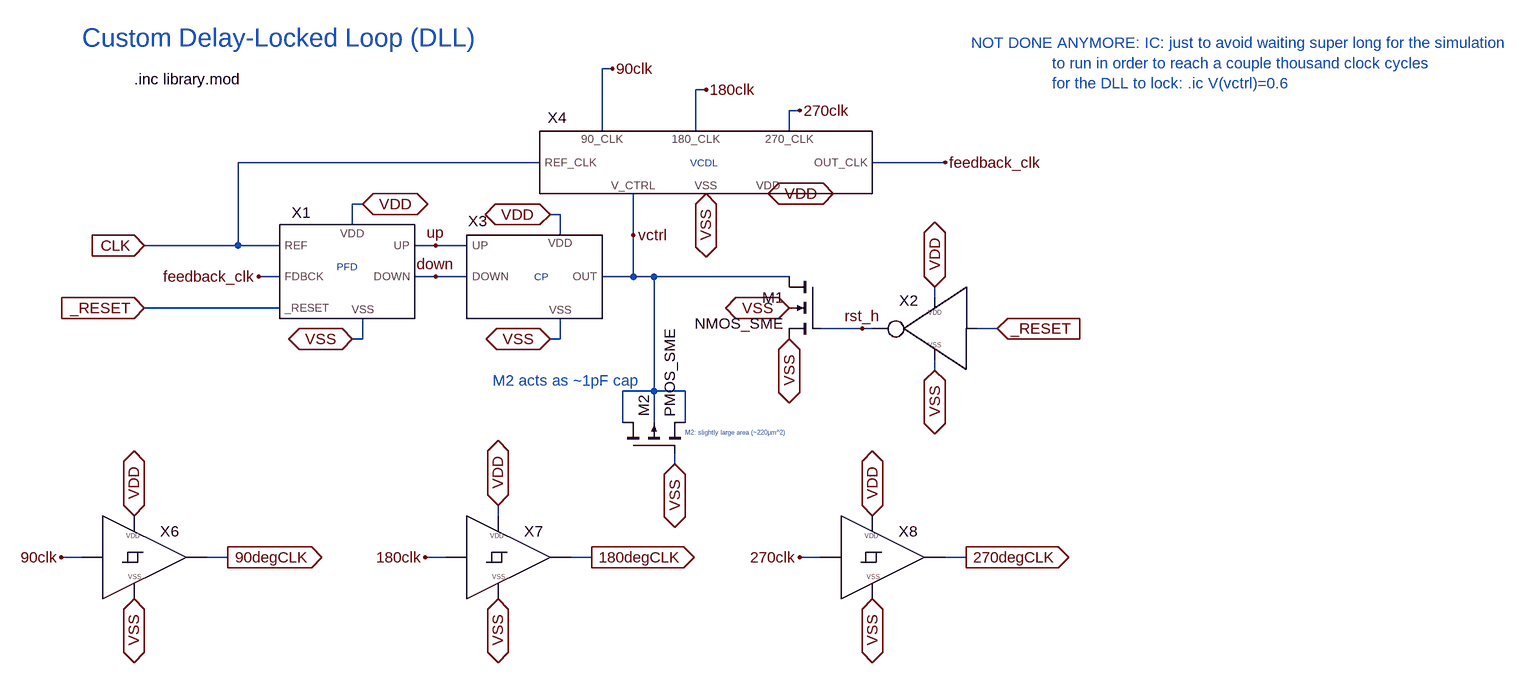
[diagram p0: schematic my_dll.asc]
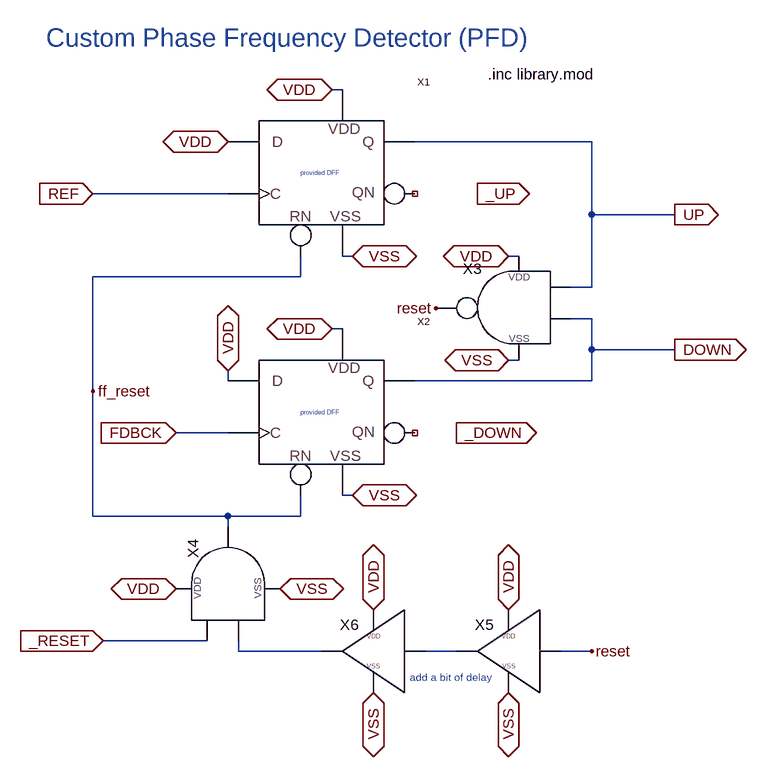
[diagram p1: sub-circuit my_pfd.asc]
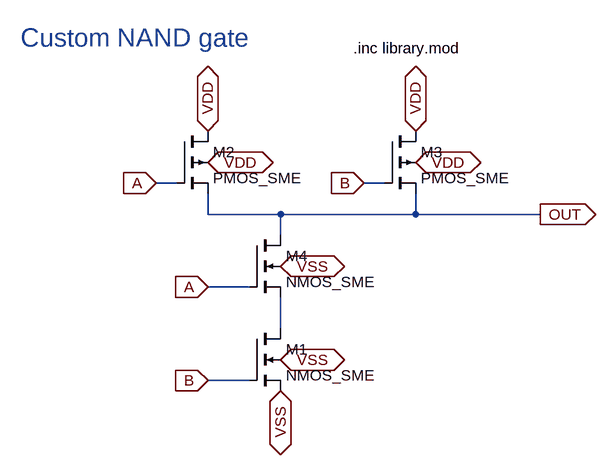
[diagram p2: sub-circuit my_nand.asc]
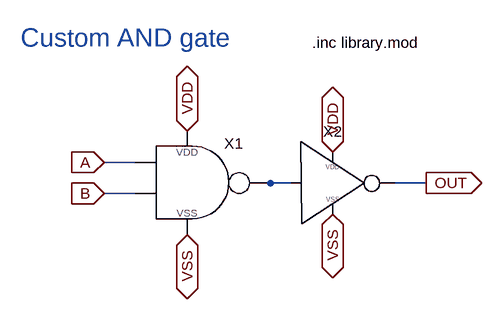
[diagram p3: sub-circuit my_and.asc]
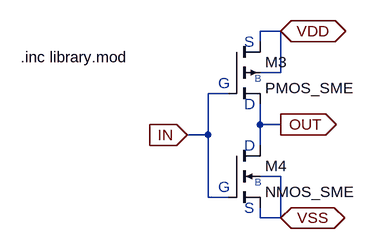
[diagram p4: sub-circuit my_inverter.asc]
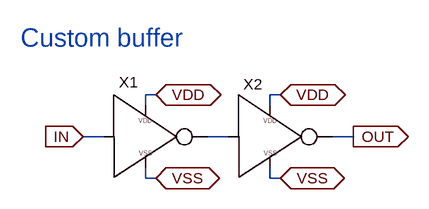
[diagram p5: sub-circuit my_buffer.asc]
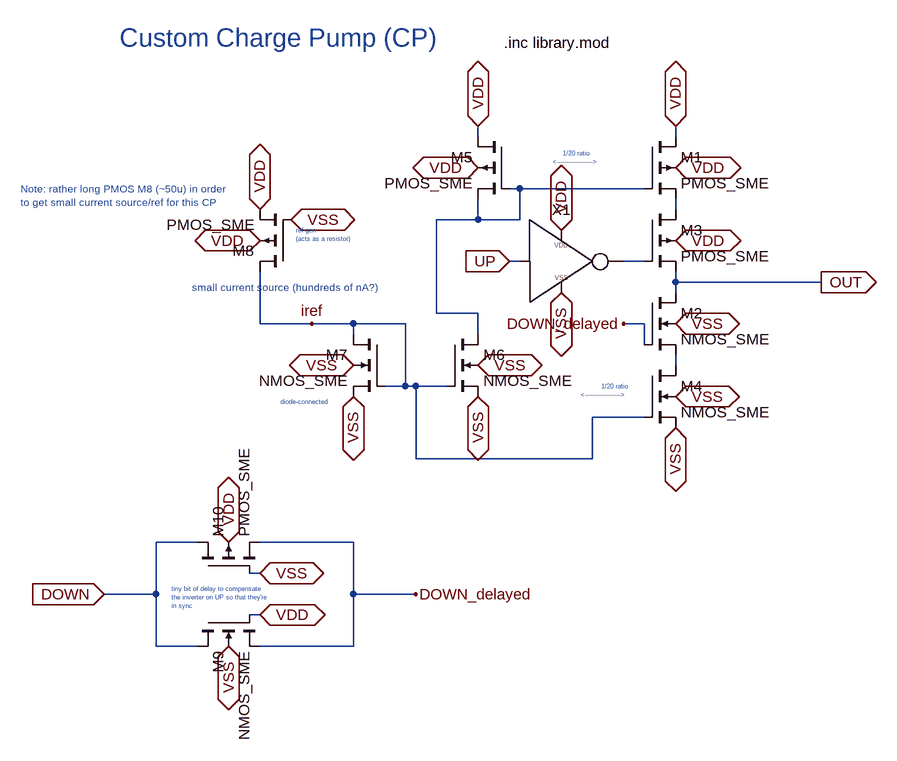
[diagram p6: sub-circuit my_cp.asc]
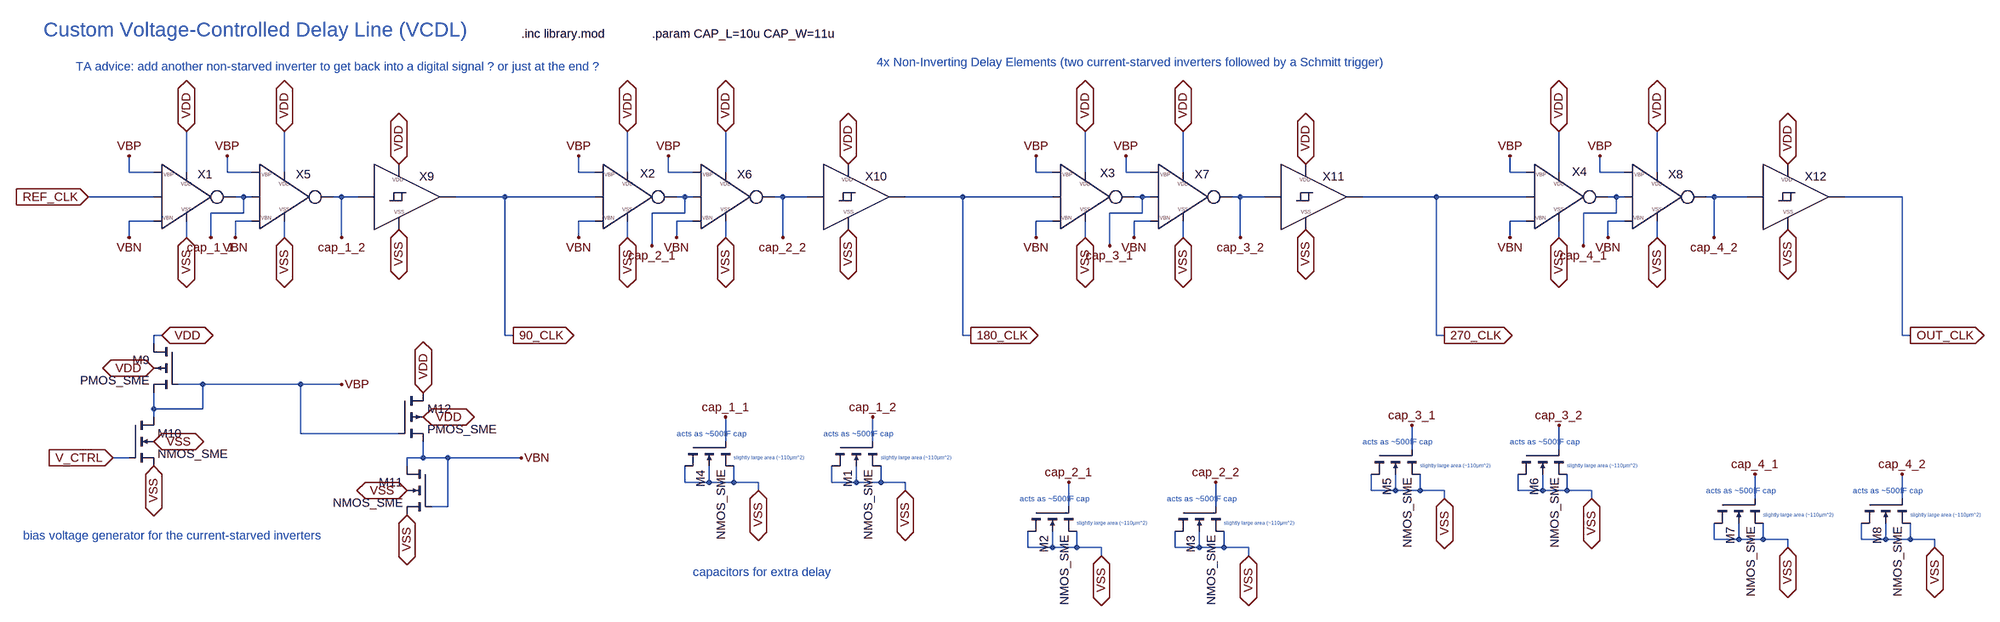
[diagram p7: sub-circuit my_vcdl.asc]
my_dll.asc, the LTspice schematic file:
Version 4.1
SHEET 1 2256 1208
WIRE 656 -16 640 -16
WIRE 800 16 784 16
WIRE 944 48 928 48
WIRE 640 80 640 -16
WIRE 784 80 784 16
WIRE 928 80 928 48
WIRE 544 128 80 128
WIRE 1168 128 1056 128
WIRE 272 192 256 192
WIRE 576 208 560 208
WIRE 256 224 256 192
WIRE 576 240 576 208
WIRE 688 240 688 176
WIRE 80 256 80 128
WIRE 80 256 -64 256
WIRE 144 256 80 256
WIRE 384 256 352 256
WIRE 432 256 384 256
WIRE 144 304 112 304
WIRE 384 304 352 304
WIRE 432 304 384 304
WIRE 688 304 688 240
WIRE 688 304 640 304
WIRE 720 304 688 304
WIRE 928 304 720 304
WIRE 1152 336 1152 320
WIRE 144 352 -64 352
WIRE 1040 384 976 384
WIRE 1056 384 1040 384
WIRE 1248 384 1216 384
WIRE 272 400 272 368
WIRE 272 400 256 400
WIRE 576 400 576 368
WIRE 576 400 560 400
WIRE 1152 448 1152 432
WIRE 720 480 720 304
WIRE 720 480 672 480
WIRE 768 480 720 480
WIRE 672 528 672 480
WIRE 720 528 720 480
WIRE 768 528 768 480
WIRE 752 592 752 576
WIRE 480 672 480 656
WIRE -160 736 -192 736
WIRE 64 736 32 736
WIRE 400 736 368 736
WIRE 624 736 592 736
WIRE 976 736 944 736
WIRE 1200 736 1168 736
FLAG -64 256 CLK
IOPIN -64 256 In
FLAG 112 304 feedback_clk
FLAG 1168 128 feedback_clk
FLAG 272 192 VDD
IOPIN 272 192 BiDir
FLAG 256 400 VSS
IOPIN 256 400 BiDir
FLAG 800 176 VSS
IOPIN 800 176 BiDir
FLAG 896 176 VDD
IOPIN 896 176 BiDir
FLAG 560 208 VDD
IOPIN 560 208 BiDir
FLAG 560 400 VSS
IOPIN 560 400 BiDir
FLAG 64 736 90degCLK
IOPIN 64 736 Out
FLAG -64 352 _RESET
IOPIN -64 352 In
FLAG 624 736 180degCLK
IOPIN 624 736 Out
FLAG 1200 736 270degCLK
IOPIN 1200 736 Out
FLAG 384 256 up
FLAG 384 304 down
FLAG 688 240 vctrl
FLAG 928 400 VSS
IOPIN 928 400 BiDir
FLAG 928 352 VSS
IOPIN 928 352 BiDir
FLAG 1248 384 _RESET
IOPIN 1248 384 In
FLAG 1152 448 VSS
IOPIN 1152 448 BiDir
FLAG 1152 320 VDD
IOPIN 1152 320 BiDir
FLAG 1040 384 rst_h
FLAG 656 -16 90clk
FLAG 800 16 180clk
FLAG 944 48 270clk
FLAG -192 736 90clk
FLAG 368 736 180clk
FLAG 944 736 270clk
FLAG -80 800 VSS
IOPIN -80 800 BiDir
FLAG 480 800 VSS
IOPIN 480 800 BiDir
FLAG 1056 800 VSS
IOPIN 1056 800 BiDir
FLAG -80 672 VDD
IOPIN -80 672 BiDir
FLAG 480 656 VDD
IOPIN 480 656 BiDir
FLAG 1056 672 VDD
IOPIN 1056 672 BiDir
FLAG 752 592 VSS
IOPIN 752 592 BiDir
SYMBOL my_pfd 240 288 R0
WINDOW 0 -63 -67 Bottom 2
SYMATTR InstName X1
SYMBOL my_cp 528 304 R0
WINDOW 0 -79 -70 Bottom 2
SYMATTR InstName X3
SYMBOL nmos4 976 304 M0
SYMATTR InstName M1
SYMATTR Value NMOS_SME
SYMATTR Value2 l=0.35u w=0.4u
SYMBOL my_inverter 1152 384 M0
WINDOW 0 40 -28 Bottom 2
SYMATTR InstName X2
SYMBOL my_vcdl 800 128 R0
WINDOW 0 -229 -53 Bottom 2
SYMATTR InstName X4
SYMBOL my_schmitt_trigger -80 736 R0
SYMATTR InstName X6
SYMBOL my_schmitt_trigger 480 736 R0
SYMATTR InstName X7
SYMBOL my_schmitt_trigger 1056 736 R0
SYMATTR InstName X8
SYMBOL pmos4 672 576 R270
SYMATTR InstName M2
SYMATTR Value PMOS_SME
SYMATTR Value2 l=10u w=22u
TEXT -160 -64 Left 4 ;Custom Delay-Locked Loop (DLL)
TEXT -80 0 Left 2 !.inc library.mod
TEXT 232 288 Left 1 ;PFD
TEXT 536 304 Left 1 ;CP
TEXT 776 128 Left 1 ;VCDL
TEXT 1208 -56 Left 2 ;NOT DONE ANYMORE: IC: just to avoid waiting super long for the simulation \n                  to run in order to reach a couple thousand clock cycles \n                  for the DLL to lock: .ic V(vctrl)=0.6
TEXT 472 464 Left 2 ;M2 acts as ~1pF cap
TEXT 768 544 Left 0 ;M2: slightly large area (~220μm^2)

my_pfd.asc, the sub-circuit schematic file:
Version 4.1
SHEET 1 1072 1336
WIRE 320 112 304 112
WIRE 704 192 432 192
WIRE 144 272 -64 272
WIRE 704 304 704 192
WIRE 832 304 704 304
WIRE 336 368 320 368
WIRE 592 368 576 368
WIRE 256 400 256 368
WIRE 256 400 -64 400
WIRE 704 416 704 304
WIRE 704 416 672 416
WIRE 704 464 672 464
WIRE 320 480 304 480
WIRE 704 512 704 464
WIRE 832 512 704 512
WIRE 592 528 576 528
WIRE 144 560 144 544
WIRE 704 560 704 512
WIRE 704 560 432 560
WIRE -64 576 -64 400
WIRE 144 640 64 640
WIRE 336 736 320 736
WIRE -64 768 -64 576
WIRE 144 768 -64 768
WIRE 256 768 256 736
WIRE 256 768 144 768
WIRE 144 784 144 768
WIRE 112 960 -48 960
WIRE 160 976 160 960
WIRE 288 976 160 976
WIRE 496 976 448 976
WIRE 704 976 656 976
FLAG 144 192 VDD
IOPIN 144 192 BiDir
FLAG 144 544 VDD
IOPIN 144 544 BiDir
FLAG 304 112 VDD
IOPIN 304 112 BiDir
FLAG 304 480 VDD
IOPIN 304 480 BiDir
FLAG 336 368 VSS
IOPIN 336 368 BiDir
FLAG 336 736 VSS
IOPIN 336 736 BiDir
FLAG -64 272 REF
IOPIN -64 272 In
FLAG 64 640 FDBCK
IOPIN 64 640 In
FLAG 832 304 UP
IOPIN 832 304 Out
FLAG 576 368 VDD
IOPIN 576 368 BiDir
FLAG 576 528 VSS
IOPIN 576 528 BiDir
FLAG -48 960 _RESET
IOPIN -48 960 In
FLAG 704 976 reset
FLAG 528 272 _UP
IOPIN 528 272 Out
FLAG 832 512 DOWN
IOPIN 832 512 Out
FLAG 496 640 _DOWN
IOPIN 496 640 Out
FLAG 464 448 reset
FLAG 224 880 VSS
IOPIN 224 880 BiDir
FLAG 64 880 VDD
IOPIN 64 880 BiDir
FLAG 368 1040 VSS
IOPIN 368 1040 BiDir
FLAG 576 1040 VSS
IOPIN 576 1040 BiDir
FLAG 368 912 VDD
IOPIN 368 912 BiDir
FLAG 576 912 VDD
IOPIN 576 912 BiDir
FLAG -64 576 ff_reset
SYMBOL DFRRLHDX1 224 208 R0
SYMATTR InstName X1
SYMBOL DFRRLHDX1 224 576 R0
SYMATTR InstName X2
SYMBOL my_nand 592 448 M0
SYMATTR InstName X3
SYMBOL my_and 144 880 R270
SYMATTR InstName X4
SYMBOL my_buffer 592 976 M0
SYMATTR InstName X5
SYMBOL my_buffer 384 976 M0
SYMATTR InstName X6
TEXT -136 32 Left 4 ;Custom Phase Frequency Detector (PFD)
TEXT 544 88 Left 2 !.inc library.mod
TEXT 256 240 Left 0 ;provided DFF
TEXT 256 608 Left 0 ;provided DFF
TEXT 424 1016 Left 1 ;add a bit of delay

my_nand.asc, the sub-circuit schematic file:
Version 4.1
SHEET 1 880 716
WIRE 128 272 96 272
WIRE 448 272 416 272
WIRE 176 320 176 288
WIRE 288 320 176 320
WIRE 496 320 496 288
WIRE 496 320 288 320
WIRE 688 320 496 320
WIRE 288 352 288 320
WIRE 240 432 176 432
WIRE 288 496 288 448
WIRE 240 576 176 576
FLAG 96 272 A
IOPIN 96 272 In
FLAG 176 432 A
IOPIN 176 432 In
FLAG 416 272 B
IOPIN 416 272 In
FLAG 176 576 B
IOPIN 176 576 In
FLAG 176 192 VDD
IOPIN 176 192 BiDir
FLAG 176 240 VDD
IOPIN 176 240 BiDir
FLAG 496 192 VDD
IOPIN 496 192 BiDir
FLAG 496 240 VDD
IOPIN 496 240 BiDir
FLAG 288 592 VSS
IOPIN 288 592 BiDir
FLAG 288 544 VSS
IOPIN 288 544 BiDir
FLAG 288 400 VSS
IOPIN 288 400 BiDir
FLAG 688 320 OUT
IOPIN 688 320 Out
SYMBOL nmos4 240 496 R0
SYMATTR InstName M1
SYMATTR Value NMOS_SME
SYMATTR Value2 l=0.35u w=0.4u
SYMBOL pmos4 128 192 R0
SYMATTR InstName M2
SYMATTR Value PMOS_SME
SYMATTR Value2 l=0.35u w=0.4u
SYMBOL pmos4 448 192 R0
SYMATTR InstName M3
SYMATTR Value PMOS_SME
SYMATTR Value2 l=0.35u w=0.4u
SYMBOL nmos4 240 352 R0
SYMATTR InstName M4
SYMATTR Value NMOS_SME
SYMATTR Value2 l=0.35u w=0.4u
TEXT -112 48 Left 4 ;Custom NAND gate
TEXT 400 64 Left 2 !.inc library.mod

my_and.asc, the sub-circuit schematic file:
Version 4.1
SHEET 1 1328 780
WIRE 96 272 48 272
WIRE 336 304 272 304
WIRE 544 304 496 304
WIRE 96 320 48 320
FLAG 176 224 VDD
IOPIN 176 224 BiDir
FLAG 176 384 VSS
IOPIN 176 384 BiDir
FLAG 48 272 A
IOPIN 48 272 In
FLAG 48 320 B
IOPIN 48 320 In
FLAG 400 352 VSS
IOPIN 400 352 BiDir
FLAG 400 256 VDD
IOPIN 400 256 BiDir
FLAG 544 304 OUT
IOPIN 544 304 Out
SYMBOL my_nand 176 304 R0
SYMATTR InstName X1
SYMBOL my_inverter 400 304 R0
SYMATTR InstName X2
TEXT -80 80 Left 4 ;Custom AND gate
TEXT 368 88 Left 2 !.inc library.mod

my_inverter.asc, the sub-circuit schematic file:
Version 4.1
SHEET 1 880 680
WIRE 608 -32 576 -32
WIRE 576 -16 576 -32
WIRE 608 32 608 -32
WIRE 608 32 576 32
WIRE 528 64 496 64
WIRE 576 112 576 80
WIRE 608 112 576 112
WIRE 496 128 496 64
WIRE 496 128 464 128
WIRE 576 144 576 112
WIRE 608 192 576 192
WIRE 496 224 496 128
WIRE 528 224 496 224
WIRE 576 256 576 240
WIRE 608 256 608 192
WIRE 608 256 576 256
FLAG 608 -32 VDD
IOPIN 608 -32 BiDir
FLAG 608 256 VSS
IOPIN 608 256 BiDir
FLAG 608 112 OUT
IOPIN 608 112 Out
FLAG 464 128 IN
IOPIN 464 128 In
SYMBOL pmos4 528 -16 R0
SYMATTR InstName M3
SYMATTR Value PMOS_SME
SYMATTR Value2 l=0.35u w=0.4u
SYMBOL nmos4 528 144 R0
SYMATTR InstName M4
SYMATTR Value NMOS_SME
SYMATTR Value2 l=0.35u w=0.4u
TEXT 552 -16 Left 2 ;S
TEXT 552 240 Left 2 ;S
TEXT 552 80 Left 2 ;D
TEXT 552 144 Left 2 ;D
TEXT 512 48 Left 2 ;G
TEXT 512 208 Left 2 ;G
TEXT 568 40 Left 1 ;B
TEXT 568 200 Left 1 ;B
TEXT 208 8 Left 2 !.inc library.mod

my_buffer.asc, the sub-circuit schematic file:
Version 4.1
SHEET 1 880 680
WIRE 112 144 96 144
WIRE 304 144 288 144
WIRE 96 160 96 144
WIRE 288 160 288 144
WIRE 32 208 0 208
WIRE 224 208 192 208
WIRE 416 208 384 208
WIRE 96 272 96 256
WIRE 112 272 96 272
WIRE 288 272 288 256
WIRE 304 272 288 272
FLAG 0 208 IN
IOPIN 0 208 In
FLAG 416 208 OUT
IOPIN 416 208 Out
FLAG 112 144 VDD
IOPIN 112 144 BiDir
FLAG 304 144 VDD
IOPIN 304 144 BiDir
FLAG 304 272 VSS
IOPIN 304 272 BiDir
FLAG 112 272 VSS
IOPIN 112 272 BiDir
SYMBOL my_inverter 96 208 R0
WINDOW 0 -26 -68 Bottom 2
SYMATTR InstName X1
SYMBOL my_inverter 288 208 R0
WINDOW 0 -26 -65 Bottom 2
SYMATTR InstName X2
TEXT -96 56 Left 4 ;Custom buffer

my_cp.asc, the sub-circuit schematic file:
Version 4.1
SHEET 1 1236 1236
WIRE 400 192 400 176
WIRE 704 192 704 176
WIRE 464 272 448 272
WIRE 656 272 464 272
WIRE 704 304 704 288
WIRE 400 320 400 288
WIRE 400 320 336 320
WIRE 464 320 464 272
WIRE 464 320 400 320
WIRE 464 384 448 384
WIRE 656 384 624 384
WIRE 704 416 704 400
WIRE 928 416 704 416
WIRE 704 432 704 416
WIRE 336 464 336 320
WIRE 400 464 336 464
WIRE 64 480 64 400
WIRE 144 480 64 480
WIRE 208 480 144 480
WIRE 288 480 208 480
WIRE 656 480 624 480
WIRE 208 496 208 480
WIRE 400 496 400 464
WIRE 656 512 656 480
WIRE 704 544 704 528
WIRE 288 576 288 480
WIRE 288 576 256 576
WIRE 304 576 288 576
WIRE 352 576 304 576
WIRE 656 624 576 624
WIRE 304 688 304 576
WIRE 576 688 576 624
WIRE 576 688 304 688
WIRE -32 816 -96 816
WIRE 208 816 64 816
WIRE 64 864 48 864
WIRE -96 896 -96 816
WIRE -96 896 -176 896
WIRE 208 896 208 816
WIRE 304 896 208 896
WIRE 64 928 48 928
WIRE -96 976 -96 896
WIRE -32 976 -96 976
WIRE 208 976 208 896
WIRE 208 976 64 976
FLAG 448 384 UP
IOPIN 448 384 In
FLAG 400 176 VDD
IOPIN 400 176 BiDir
FLAG 928 416 OUT
IOPIN 928 416 Out
FLAG 704 640 VSS
IOPIN 704 640 BiDir
FLAG 704 592 VSS
IOPIN 704 592 BiDir
FLAG 704 480 VSS
IOPIN 704 480 BiDir
FLAG 704 176 VDD
IOPIN 704 176 BiDir
FLAG 704 240 VDD
IOPIN 704 240 BiDir
FLAG 704 352 VDD
IOPIN 704 352 BiDir
FLAG 400 240 VDD
IOPIN 400 240 BiDir
FLAG 400 592 VSS
IOPIN 400 592 BiDir
FLAG 400 544 VSS
IOPIN 400 544 BiDir
FLAG 208 592 VSS
IOPIN 208 592 BiDir
FLAG 208 544 VSS
IOPIN 208 544 BiDir
FLAG 528 336 VDD
IOPIN 528 336 BiDir
FLAG 528 432 VSS
IOPIN 528 432 BiDir
FLAG 112 320 VSS
IOPIN 112 320 BiDir
FLAG 64 304 VDD
IOPIN 64 304 BiDir
FLAG 64 352 VDD
IOPIN 64 352 BiDir
FLAG 144 480 iref
FLAG 624 480 DOWN_delayed
FLAG 304 896 DOWN_delayed
FLAG -176 896 DOWN
IOPIN -176 896 In
FLAG 16 976 VSS
IOPIN 16 976 BiDir
FLAG 64 928 VDD
IOPIN 64 928 BiDir
FLAG 16 816 VDD
IOPIN 16 816 BiDir
FLAG 64 864 VSS
IOPIN 64 864 BiDir
SYMBOL pmos4 656 192 R0
SYMATTR InstName M1
SYMATTR Value PMOS_SME
SYMATTR Value2 l=5u w=0.8u
SYMBOL nmos4 656 432 R0
SYMATTR InstName M2
SYMATTR Value NMOS_SME
SYMATTR Value2 l=0.35u w=0.4u
SYMBOL pmos4 656 304 R0
SYMATTR InstName M3
SYMATTR Value PMOS_SME
SYMATTR Value2 l=0.35u w=0.4u
SYMBOL nmos4 656 544 R0
SYMATTR InstName M4
SYMATTR Value NMOS_SME
SYMATTR Value2 l=5u w=0.4u
SYMBOL pmos4 448 192 M0
SYMATTR InstName M5
SYMATTR Value PMOS_SME
SYMATTR Value2 l=5u w=16u
SYMBOL nmos4 352 496 R0
SYMATTR InstName M6
SYMATTR Value NMOS_SME
SYMATTR Value2 l=5u w=8u
SYMBOL nmos4 256 496 M0
SYMATTR InstName M7
SYMATTR Value NMOS_SME
SYMATTR Value2 l=5u w=8u
SYMBOL my_inverter 528 384 R0
SYMATTR InstName X1
SYMBOL pmos4 112 400 R180
SYMATTR InstName M8
SYMATTR Value PMOS_SME
SYMATTR Value2 l=50u w=0.4u
SYMBOL nmos4 -32 928 M90
SYMATTR InstName M9
SYMATTR Value NMOS_SME
SYMATTR Value2 l=0.35u w=0.4u
SYMBOL pmos4 -32 864 R270
SYMATTR InstName M10
SYMATTR Value PMOS_SME
SYMATTR Value2 l=0.35u w=0.4u
TEXT -152 40 Left 4 ;Custom Charge Pump (CP)
TEXT 440 48 Left 2 !.inc library.mod
TEXT 96 600 Left 0 ;diode-connected
TEXT 552 224 Center 0 ;1/20 ratio\n<------------------>
TEXT 632 576 Right 0 ;1/20 ratio\n<------------------>
TEXT 120 336 Left 0 ;ref gen\n(acts as a resistor)
TEXT -40 424 Left 1 ;small current source (hundreds of nA?)
TEXT -304 272 Left 1 ;Note: rather long PMOS M8 (~50u) in order\nto get small current source/ref for this CP
TEXT -72 888 Left 0 ;tiny bit of delay to compensate\nthe inverter on UP so that they're\nin sync

my_vcdl.asc, the sub-circuit schematic file:
Version 4.1
SHEET 1 3608 1576
WIRE -48 160 -48 128
WIRE 0 160 -48 160
WIRE 64 160 64 80
WIRE 144 160 144 128
WIRE 192 160 144 160
WIRE 256 160 256 80
WIRE 832 160 832 128
WIRE 864 160 832 160
WIRE 928 160 928 80
WIRE 1008 160 1008 128
WIRE 1056 160 1008 160
WIRE 1120 160 1120 80
WIRE 1728 160 1728 128
WIRE 1760 160 1728 160
WIRE 1824 160 1824 80
WIRE 1904 160 1904 128
WIRE 1952 160 1904 160
WIRE 2016 160 2016 80
WIRE 2656 160 2656 128
WIRE 2688 160 2656 160
WIRE 2752 160 2752 80
WIRE 2832 160 2832 128
WIRE 2880 160 2832 160
WIRE 2944 160 2944 80
WIRE 0 208 -128 208
WIRE 176 208 160 208
WIRE 192 208 176 208
WIRE 368 208 352 208
WIRE 400 208 368 208
WIRE 688 208 592 208
WIRE 864 208 688 208
WIRE 1040 208 1024 208
WIRE 1056 208 1040 208
WIRE 1232 208 1216 208
WIRE 1280 208 1232 208
WIRE 1584 208 1472 208
WIRE 1760 208 1584 208
WIRE 1936 208 1920 208
WIRE 1952 208 1936 208
WIRE 2128 208 2112 208
WIRE 2176 208 2128 208
WIRE 2512 208 2368 208
WIRE 2688 208 2512 208
WIRE 2864 208 2848 208
WIRE 2880 208 2864 208
WIRE 3056 208 3040 208
WIRE 3120 208 3056 208
WIRE 3424 208 3312 208
WIRE 176 240 176 208
WIRE 176 240 112 240
WIRE 1040 240 1040 208
WIRE 1040 240 976 240
WIRE 1936 240 1936 208
WIRE 1936 240 1872 240
WIRE 2864 240 2864 208
WIRE 2864 240 2800 240
WIRE 0 256 -48 256
WIRE 192 256 160 256
WIRE 864 256 832 256
WIRE 1056 256 1024 256
WIRE 1760 256 1728 256
WIRE 1952 256 1920 256
WIRE 2688 256 2656 256
WIRE 2880 256 2848 256
WIRE -48 288 -48 256
WIRE 64 288 64 256
WIRE 112 288 112 240
WIRE 160 288 160 256
WIRE 256 288 256 256
WIRE 368 288 368 208
WIRE 832 288 832 256
WIRE 928 288 928 256
WIRE 1024 288 1024 256
WIRE 1120 288 1120 256
WIRE 1232 288 1232 208
WIRE 1728 288 1728 256
WIRE 1824 288 1824 256
WIRE 1920 288 1920 256
WIRE 2016 288 2016 256
WIRE 2128 288 2128 208
WIRE 2656 288 2656 256
WIRE 2752 288 2752 256
WIRE 2848 288 2848 256
WIRE 2944 288 2944 256
WIRE 3056 288 3056 208
WIRE 976 304 976 240
WIRE 1872 304 1872 240
WIRE 2800 304 2800 240
WIRE 16 480 0 480
WIRE 688 480 688 208
WIRE 704 480 688 480
WIRE 1584 480 1584 208
WIRE 1600 480 1584 480
WIRE 2512 480 2512 208
WIRE 2528 480 2512 480
WIRE 3424 480 3424 208
WIRE 3440 480 3424 480
WIRE 0 496 0 480
WIRE 96 576 48 576
WIRE 288 576 96 576
WIRE 368 576 288 576
WIRE 0 624 0 592
WIRE 96 624 96 576
WIRE 96 624 0 624
WIRE 0 640 0 624
WIRE 288 672 288 576
WIRE 480 672 288 672
WIRE 1120 688 1120 640
WIRE 1408 688 1408 640
WIRE 2464 704 2464 656
WIRE 2752 704 2752 656
WIRE -48 720 -80 720
WIRE 528 720 528 688
WIRE 528 720 496 720
WIRE 576 720 528 720
WIRE 720 720 576 720
WIRE 496 736 496 720
WIRE 1040 768 1040 736
WIRE 1088 768 1088 736
WIRE 1088 768 1040 768
WIRE 1136 768 1136 736
WIRE 1136 768 1088 768
WIRE 1184 768 1136 768
WIRE 1328 768 1328 736
WIRE 1376 768 1376 736
WIRE 1376 768 1328 768
WIRE 1424 768 1424 736
WIRE 1424 768 1376 768
WIRE 1472 768 1424 768
WIRE 1184 784 1184 768
WIRE 1472 784 1472 768
WIRE 2384 784 2384 752
WIRE 2432 784 2432 752
WIRE 2432 784 2384 784
WIRE 2480 784 2480 752
WIRE 2480 784 2432 784
WIRE 2528 784 2480 784
WIRE 2672 784 2672 752
WIRE 2720 784 2720 752
WIRE 2720 784 2672 784
WIRE 2768 784 2768 752
WIRE 2768 784 2720 784
WIRE 2816 784 2768 784
WIRE 2528 800 2528 784
WIRE 2816 800 2816 784
WIRE 3136 800 3136 752
WIRE 3424 800 3424 752
WIRE 576 816 576 720
WIRE 576 816 544 816
WIRE 1792 816 1792 768
WIRE 2080 816 2080 768
WIRE 3056 880 3056 848
WIRE 3104 880 3104 848
WIRE 3104 880 3056 880
WIRE 3152 880 3152 848
WIRE 3152 880 3104 880
WIRE 3200 880 3152 880
WIRE 3344 880 3344 848
WIRE 3392 880 3392 848
WIRE 3392 880 3344 880
WIRE 3440 880 3440 848
WIRE 3440 880 3392 880
WIRE 3488 880 3440 880
WIRE 1712 896 1712 864
WIRE 1760 896 1760 864
WIRE 1760 896 1712 896
WIRE 1808 896 1808 864
WIRE 1808 896 1760 896
WIRE 1856 896 1808 896
WIRE 2000 896 2000 864
WIRE 2048 896 2048 864
WIRE 2048 896 2000 896
WIRE 2096 896 2096 864
WIRE 2096 896 2048 896
WIRE 2144 896 2096 896
WIRE 3200 896 3200 880
WIRE 3488 896 3488 880
WIRE 1856 912 1856 896
WIRE 2144 912 2144 896
FLAG -128 208 REF_CLK
IOPIN -128 208 In
FLAG -80 720 V_CTRL
IOPIN -80 720 In
FLAG 3440 480 OUT_CLK
IOPIN 3440 480 Out
FLAG 1600 480 180_CLK
IOPIN 1600 480 Out
FLAG 704 480 90_CLK
IOPIN 704 480 Out
FLAG 2528 480 270_CLK
IOPIN 2528 480 Out
FLAG 16 480 VDD
IOPIN 16 480 BiDir
FLAG 0 736 VSS
IOPIN 0 736 BiDir
FLAG 0 688 VSS
IOPIN 0 688 BiDir
FLAG 0 544 VDD
IOPIN 0 544 BiDir
FLAG 64 288 VSS
IOPIN 64 288 BiDir
FLAG 928 288 VSS
IOPIN 928 288 BiDir
FLAG 1824 288 VSS
IOPIN 1824 288 BiDir
FLAG 2752 288 VSS
IOPIN 2752 288 BiDir
FLAG 2752 80 VDD
IOPIN 2752 80 BiDir
FLAG 1824 80 VDD
IOPIN 1824 80 BiDir
FLAG 928 80 VDD
IOPIN 928 80 BiDir
FLAG 64 80 VDD
IOPIN 64 80 BiDir
FLAG 256 288 VSS
IOPIN 256 288 BiDir
FLAG 1120 288 VSS
IOPIN 1120 288 BiDir
FLAG 2016 288 VSS
IOPIN 2016 288 BiDir
FLAG 2944 288 VSS
IOPIN 2944 288 BiDir
FLAG 2944 80 VDD
IOPIN 2944 80 BiDir
FLAG 2016 80 VDD
IOPIN 2016 80 BiDir
FLAG 1120 80 VDD
IOPIN 1120 80 BiDir
FLAG 256 80 VDD
IOPIN 256 80 BiDir
FLAG 368 576 VBP
FLAG 720 720 VBN
FLAG 1008 128 VBP
FLAG 1024 288 VBN
FLAG 832 128 VBP
FLAG 144 128 VBP
FLAG -48 128 VBP
FLAG 1728 128 VBP
FLAG 1904 128 VBP
FLAG 2656 128 VBP
FLAG 2832 128 VBP
FLAG 1728 288 VBN
FLAG 1920 288 VBN
FLAG 2656 288 VBN
FLAG 2848 288 VBN
FLAG 832 288 VBN
FLAG 160 288 VBN
FLAG -48 288 VBN
FLAG 480 144 VDD
IOPIN 480 144 BiDir
FLAG 480 272 VSS
IOPIN 480 272 BiDir
FLAG 1360 144 VDD
IOPIN 1360 144 BiDir
FLAG 1360 272 VSS
IOPIN 1360 272 BiDir
FLAG 2256 144 VDD
IOPIN 2256 144 BiDir
FLAG 2256 272 VSS
IOPIN 2256 272 BiDir
FLAG 3200 144 VDD
IOPIN 3200 144 BiDir
FLAG 3200 272 VSS
IOPIN 3200 272 BiDir
FLAG 496 784 VSS
IOPIN 496 784 BiDir
FLAG 528 640 VDD
IOPIN 528 640 BiDir
FLAG 528 592 VDD
IOPIN 528 592 BiDir
FLAG 496 832 VSS
IOPIN 496 832 BiDir
FLAG 1184 784 VSS
IOPIN 1184 784 BiDir
FLAG 1120 640 cap_1_1
FLAG 1472 784 VSS
IOPIN 1472 784 BiDir
FLAG 1408 640 cap_1_2
FLAG 1856 912 VSS
IOPIN 1856 912 BiDir
FLAG 1792 768 cap_2_1
FLAG 2144 912 VSS
IOPIN 2144 912 BiDir
FLAG 2080 768 cap_2_2
FLAG 2528 800 VSS
IOPIN 2528 800 BiDir
FLAG 2464 656 cap_3_1
FLAG 2816 800 VSS
IOPIN 2816 800 BiDir
FLAG 2752 656 cap_3_2
FLAG 3200 896 VSS
IOPIN 3200 896 BiDir
FLAG 3136 752 cap_4_1
FLAG 3488 896 VSS
IOPIN 3488 896 BiDir
FLAG 3424 752 cap_4_2
FLAG 112 288 cap_1_1
FLAG 368 288 cap_1_2
FLAG 976 304 cap_2_1
FLAG 1232 288 cap_2_2
FLAG 1872 304 cap_3_1
FLAG 2128 288 cap_3_2
FLAG 2800 304 cap_4_1
FLAG 3056 288 cap_4_2
SYMBOL pmos4 48 496 M0
SYMATTR InstName M9
SYMATTR Value PMOS_SME
SYMATTR Value2 l=2u w=2u
SYMBOL nmos4 -48 640 R0
SYMATTR InstName M10
SYMATTR Value NMOS_SME
SYMATTR Value2 l=2u w=0.4u
SYMBOL my_current_starved_inverter 64 208 R0
WINDOW 0 37 -28 Bottom 2
SYMATTR InstName X1
SYMBOL my_current_starved_inverter 928 208 R0
WINDOW 0 39 -30 Bottom 2
SYMATTR InstName X2
SYMBOL my_current_starved_inverter 1824 208 R0
WINDOW 0 44 -31 Bottom 2
SYMATTR InstName X3
SYMBOL my_current_starved_inverter 2752 208 R0
WINDOW 0 40 -33 Bottom 2
SYMATTR InstName X4
SYMBOL my_current_starved_inverter 256 208 R0
WINDOW 0 37 -28 Bottom 2
SYMATTR InstName X5
SYMBOL my_current_starved_inverter 1120 208 R0
WINDOW 0 37 -28 Bottom 2
SYMATTR InstName X6
SYMBOL my_current_starved_inverter 2016 208 R0
WINDOW 0 37 -28 Bottom 2
SYMATTR InstName X7
SYMBOL my_current_starved_inverter 2944 208 R0
WINDOW 0 37 -28 Bottom 2
SYMATTR InstName X8
SYMBOL my_schmitt_trigger 480 208 R0
SYMATTR InstName X9
SYMBOL my_schmitt_trigger 1360 208 R0
SYMATTR InstName X10
SYMBOL my_schmitt_trigger 2256 208 R0
SYMATTR InstName X11
SYMBOL my_schmitt_trigger 3200 208 R0
SYMATTR InstName X12
SYMBOL nmos4 544 736 M0
SYMATTR InstName M11
SYMATTR Value NMOS_SME
SYMATTR Value2 l=2u w=0.4u
SYMBOL pmos4 480 592 R0
SYMATTR InstName M12
SYMATTR Value PMOS_SME
SYMATTR Value2 l=2u w=2u
SYMBOL nmos4 1040 688 M90
SYMATTR InstName M4
SYMATTR Value NMOS_SME
SYMATTR Value2 l={CAP_L} w={CAP_W}
SYMBOL nmos4 1328 688 M90
SYMATTR InstName M1
SYMATTR Value NMOS_SME
SYMATTR Value2 l={CAP_L} w={CAP_W}
SYMBOL nmos4 1712 816 M90
SYMATTR InstName M2
SYMATTR Value NMOS_SME
SYMATTR Value2 l={CAP_L} w={CAP_W}
SYMBOL nmos4 2000 816 M90
SYMATTR InstName M3
SYMATTR Value NMOS_SME
SYMATTR Value2 l={CAP_L} w={CAP_W}
SYMBOL nmos4 2384 704 M90
SYMATTR InstName M5
SYMATTR Value NMOS_SME
SYMATTR Value2 l={CAP_L} w={CAP_W}
SYMBOL nmos4 2672 704 M90
SYMATTR InstName M6
SYMATTR Value NMOS_SME
SYMATTR Value2 l={CAP_L} w={CAP_W}
SYMBOL nmos4 3056 800 M90
SYMATTR InstName M7
SYMATTR Value NMOS_SME
SYMATTR Value2 l={CAP_L} w={CAP_W}
SYMBOL nmos4 3344 800 M90
SYMATTR InstName M8
SYMATTR Value NMOS_SME
SYMATTR Value2 l={CAP_L} w={CAP_W}
TEXT -216 -120 Left 4 ;Custom Voltage-Controlled Delay Line (VCDL)
TEXT 720 -112 Left 2 !.inc library.mod
TEXT -152 -48 Left 2 ;TA advice: add another non-starved inverter to get back into a digital signal ? or just at the end ?
TEXT 1416 -56 Left 2 ;4x Non-Inverting Delay Elements (two current-starved inverters followed by a Schmitt trigger)
TEXT -256 872 Left 2 ;bias voltage generator for the current-starved inverters
TEXT 1136 720 Left 0 ;slightly large area (~110μm^2)
TEXT 1024 672 Left 1 ;acts as ~500fF cap
TEXT 1424 720 Left 0 ;slightly large area (~110μm^2)
TEXT 1312 672 Left 1 ;acts as ~500fF cap
TEXT 1808 848 Left 0 ;slightly large area (~110μm^2)
TEXT 1696 800 Left 1 ;acts as ~500fF cap
TEXT 2096 848 Left 0 ;slightly large area (~110μm^2)
TEXT 1984 800 Left 1 ;acts as ~500fF cap
TEXT 2480 736 Left 0 ;slightly large area (~110μm^2)
TEXT 2368 688 Left 1 ;acts as ~500fF cap
TEXT 2768 736 Left 0 ;slightly large area (~110μm^2)
TEXT 2656 688 Left 1 ;acts as ~500fF cap
TEXT 3152 832 Left 0 ;slightly large area (~110μm^2)
TEXT 3040 784 Left 1 ;acts as ~500fF cap
TEXT 3440 832 Left 0 ;slightly large area (~110μm^2)
TEXT 3328 784 Left 1 ;acts as ~500fF cap
TEXT 976 -112 Left 2 !.param CAP_L=10u CAP_W=11u
TEXT 1056 944 Left 2 ;capacitors for extra delay

my_current_starved_inverter.asc, the sub-circuit schematic file:
Version 4.1
SHEET 1 1424 920
WIRE 496 80 480 80
WIRE 528 80 496 80
WIRE 576 128 576 96
WIRE 496 208 496 80
WIRE 496 208 384 208
WIRE 528 208 496 208
WIRE 576 272 576 224
WIRE 528 352 496 352
WIRE 576 400 576 368
WIRE 800 400 576 400
WIRE 496 416 496 352
WIRE 496 416 336 416
WIRE 576 432 576 400
WIRE 496 512 496 416
WIRE 528 512 496 512
WIRE 576 576 576 528
WIRE 496 656 384 656
WIRE 528 656 496 656
WIRE 576 704 576 672
WIRE 496 784 496 656
WIRE 496 784 480 784
WIRE 528 784 496 784
FLAG 576 320 VDD
IOPIN 576 320 BiDir
FLAG 576 480 VSS
IOPIN 576 480 BiDir
FLAG 800 400 OUT
IOPIN 800 400 Out
FLAG 336 416 IN
IOPIN 336 416 In
FLAG 576 624 VSS
IOPIN 576 624 BiDir
FLAG 576 176 VDD
IOPIN 576 176 BiDir
FLAG 576 0 VDD
IOPIN 576 0 BiDir
FLAG 576 800 VSS
IOPIN 576 800 BiDir
FLAG 480 80 VBP
IOPIN 480 80 In
FLAG 480 784 VBN
IOPIN 480 784 In
FLAG 576 752 VSS
IOPIN 576 752 BiDir
FLAG 576 48 VDD
IOPIN 576 48 BiDir
SYMBOL pmos4 528 272 R0
SYMATTR InstName M3
SYMATTR Value PMOS_SME
SYMATTR Value2 l=0.35u w=1.2u
SYMBOL nmos4 528 432 R0
SYMATTR InstName M4
SYMATTR Value NMOS_SME
SYMATTR Value2 l=0.35u w=0.4u
SYMBOL pmos4 528 128 R0
SYMATTR InstName M1
SYMATTR Value PMOS_SME
SYMATTR Value2 l=2u w=2.35u
SYMBOL nmos4 528 576 R0
SYMATTR InstName M2
SYMATTR Value NMOS_SME
SYMATTR Value2 l=2u w=0.4u
SYMBOL nmos4 528 704 R0
SYMATTR InstName M5
SYMATTR Value NMOS_SME
SYMATTR Value2 l=2u w=0.4u
SYMBOL pmos4 528 0 R0
SYMATTR InstName M6
SYMATTR Value PMOS_SME
SYMATTR Value2 l=2u w=2.35u
TEXT 552 272 Left 2 ;S
TEXT 552 528 Left 2 ;S
TEXT 552 368 Left 2 ;D
TEXT 552 432 Left 2 ;D
TEXT 512 336 Left 2 ;G
TEXT 512 496 Left 2 ;G
TEXT 568 328 Left 1 ;B
TEXT 568 488 Left 1 ;B
TEXT 824 -152 Left 2 !.inc library.mod
TEXT 160 -152 Left 4 ;Custom current-starved inverter
TEXT 704 608 Left 1 ;cascode? -> output resistance increases (from $r_o$ to roughly $g_m \\cdot r_o^2$ ?)
TEXT 752 168 Left 1 ;cascode? -> output resistance increases (from $r_o$ to roughly $g_m \\cdot r_o^2$ ?)
TEXT 720 32 Left 1 ;starvation pmos
TEXT 712 744 Left 1 ;starvation nmos

my_schmitt_trigger.asc, the sub-circuit schematic file:
Version 4.1
SHEET 1 1300 892
WIRE 160 256 96 256
WIRE 208 288 208 272
WIRE 576 288 208 288
WIRE 208 304 208 288
WIRE 576 352 576 288
WIRE 576 352 544 352
WIRE 96 384 96 256
WIRE 160 384 96 384
WIRE 96 448 96 384
WIRE 96 448 -32 448
WIRE 208 448 208 400
WIRE 320 448 208 448
WIRE 464 448 320 448
WIRE 528 448 528 400
WIRE 528 448 464 448
WIRE 656 448 528 448
WIRE 928 448 816 448
WIRE 208 496 208 448
WIRE 464 496 464 448
WIRE 576 544 544 544
WIRE 96 576 96 448
WIRE 160 576 96 576
WIRE 208 608 208 592
WIRE 576 608 576 544
WIRE 576 608 208 608
WIRE 208 624 208 608
WIRE 96 704 96 576
WIRE 160 704 96 704
FLAG -32 448 IN
IOPIN -32 448 In
FLAG 928 448 OUT
IOPIN 928 448 Out
FLAG 208 176 VDD
IOPIN 208 176 BiDir
FLAG 208 224 VDD
IOPIN 208 224 BiDir
FLAG 208 352 VDD
IOPIN 208 352 BiDir
FLAG 208 720 VSS
IOPIN 208 720 BiDir
FLAG 448 352 VSS
IOPIN 448 352 BiDir
FLAG 496 352 VDD
IOPIN 496 352 BiDir
FLAG 496 544 VSS
IOPIN 496 544 BiDir
FLAG 208 544 VSS
IOPIN 208 544 BiDir
FLAG 208 672 VSS
IOPIN 208 672 BiDir
FLAG 448 544 VDD
IOPIN 448 544 BiDir
FLAG 320 448 n_inv
FLAG 720 400 VDD
IOPIN 720 400 BiDir
FLAG 720 496 VSS
IOPIN 720 496 BiDir
SYMBOL pmos4 160 176 R0
SYMATTR InstName M1
SYMATTR Value PMOS_SME
SYMATTR Value2 l=0.35u w=2u
SYMBOL nmos4 160 496 R0
SYMATTR InstName M2
SYMATTR Value NMOS_SME
SYMATTR Value2 l=0.35u w=1u
SYMBOL pmos4 160 304 R0
SYMATTR InstName M3
SYMATTR Value PMOS_SME
SYMATTR Value2 l=0.35u w=2u
SYMBOL nmos4 160 624 R0
SYMATTR InstName M4
SYMATTR Value NMOS_SME
SYMATTR Value2 l=0.35u w=1u
SYMBOL pmos4 448 400 R270
SYMATTR InstName M5
SYMATTR Value PMOS_SME
SYMATTR Value2 l=0.35u w=0.8u
SYMBOL nmos4 544 496 R90
SYMATTR InstName M6
SYMATTR Value NMOS_SME
SYMATTR Value2 l=0.35u w=0.4u
SYMBOL my_inverter 720 448 R0
WINDOW 0 -40 -69 Bottom 2
SYMATTR InstName X1
TEXT -72 48 Left 4 ;Custom Schmitt trigger
TEXT 464 56 Left 2 !.inc library.mod
TEXT 392 320 Left 2 ;/!\\
TEXT 392 512 Left 2 ;/!\\
TEXT 392 376 Left 0 ;not VDD
TEXT 392 568 Left 0 ;not VSS

The netlist it stands for:
* my_dll.asc
X§X1 feedback_clk CLK down up VDD VSS _RESET my_pfd
X§X3 down up vctrl VDD VSS my_cp
M1 vctrl rst_h VSS VSS NMOS_SME l=0.35u w=0.4u
X§X2 _RESET rst_h VDD VSS my_inverter
X§X4 CLK vctrl 180clk 270clk 90clk feedback_clk VDD VSS my_vcdl
X§X6 90clk 90degCLK VDD VSS my_schmitt_trigger
X§X7 180clk 180degCLK VDD VSS my_schmitt_trigger
X§X8 270clk 270degCLK VDD VSS my_schmitt_trigger
M2 vctrl VSS vctrl vctrl PMOS_SME l=10u w=22u

* block symbol definitions
.subckt my_pfd FDBCK REF DOWN UP VDD VSS _RESET
X§X1 VDD REF ff_reset NC_01 UP VDD VSS DFRRLHDX1  ; pins D C RN QN Q VDD VSS
X§X2 VDD FDBCK ff_reset NC_02 DOWN VDD VSS DFRRLHDX1  ; pins D C RN QN Q VDD VSS
X§X3 UP DOWN reset VDD VSS my_nand
X§X4 _RESET N001 ff_reset VDD VSS my_and
X§X5 reset N002 VDD VSS my_buffer
X§X6 N002 N001 VDD VSS my_buffer
* Custom Phase Frequency Detector (PFD)
.inc library.mod
* provided DFF
* provided DFF
* add a bit of delay
.ends my_pfd

.subckt my_nand A B OUT VDD VSS
M1 N001 B VSS VSS NMOS_SME l=0.35u w=0.4u
M2 VDD A OUT VDD PMOS_SME l=0.35u w=0.4u
M3 VDD B OUT VDD PMOS_SME l=0.35u w=0.4u
M4 OUT A N001 VSS NMOS_SME l=0.35u w=0.4u
* Custom NAND gate
.inc library.mod
.ends my_nand

.subckt my_and A B OUT VDD VSS
X§X1 A B N001 VDD VSS my_nand
X§X2 N001 OUT VDD VSS my_inverter
* Custom AND gate
.inc library.mod
.ends my_and

.subckt my_inverter IN OUT VDD VSS
M3 VDD IN OUT VDD PMOS_SME l=0.35u w=0.4u
M4 OUT IN VSS VSS NMOS_SME l=0.35u w=0.4u
* S
* S
* D
* D
* G
* G
* B
* B
.inc library.mod
.ends my_inverter

.subckt my_buffer IN OUT VDD VSS
X§X1 IN N001 VDD VSS my_inverter
X§X2 N001 OUT VDD VSS my_inverter
* Custom buffer
.ends my_buffer

.subckt my_cp DOWN UP OUT VDD VSS
M1 VDD N001 N002 VDD PMOS_SME l=5u w=0.8u
M2 OUT DOWN_delayed N004 VSS NMOS_SME l=0.35u w=0.4u
M3 N002 N003 OUT VDD PMOS_SME l=0.35u w=0.4u
M4 N004 iref VSS VSS NMOS_SME l=5u w=0.4u
M5 VDD N001 N001 VDD PMOS_SME l=5u w=16u
M6 N001 iref VSS VSS NMOS_SME l=5u w=8u
M7 iref iref VSS VSS NMOS_SME l=5u w=8u
X§X1 UP N003 VDD VSS my_inverter
M8 iref VSS VDD VDD PMOS_SME l=50u w=0.4u
M9 DOWN VDD DOWN_delayed VSS NMOS_SME l=0.35u w=0.4u
M10 DOWN VSS DOWN_delayed VDD PMOS_SME l=0.35u w=0.4u
* Custom Charge Pump (CP)
.inc library.mod
* diode-connected
* 1/20 ratio
* <------------------>
* 1/20 ratio
* <------------------>
* ref gen
* (acts as a resistor)
* small current source (hundreds of nA?)
* Note: rather long PMOS M8 (~50u) in order
* to get small current source/ref for this CP
* tiny bit of delay to compensate
* the inverter on UP so that they're
* in sync
.ends my_cp

.subckt my_vcdl REF_CLK V_CTRL 180_CLK 270_CLK 90_CLK OUT_CLK VDD VSS
M9 VDD VBP VBP VDD PMOS_SME l=2u w=2u
M10 VBP V_CTRL VSS VSS NMOS_SME l=2u w=0.4u
X§X1 REF_CLK cap_1_1 VDD VSS VBP VBN my_current_starved_inverter
X§X2 90_CLK cap_2_1 VDD VSS VBP VBN my_current_starved_inverter
X§X3 180_CLK cap_3_1 VDD VSS VBP VBN my_current_starved_inverter
X§X4 270_CLK cap_4_1 VDD VSS VBP VBN my_current_starved_inverter
X§X5 cap_1_1 cap_1_2 VDD VSS VBP VBN my_current_starved_inverter
X§X6 cap_2_1 cap_2_2 VDD VSS VBP VBN my_current_starved_inverter
X§X7 cap_3_1 cap_3_2 VDD VSS VBP VBN my_current_starved_inverter
X§X8 cap_4_1 cap_4_2 VDD VSS VBP VBN my_current_starved_inverter
X§X9 cap_1_2 90_CLK VDD VSS my_schmitt_trigger
X§X10 cap_2_2 180_CLK VDD VSS my_schmitt_trigger
X§X11 cap_3_2 270_CLK VDD VSS my_schmitt_trigger
X§X12 cap_4_2 OUT_CLK VDD VSS my_schmitt_trigger
M11 VBN VBN VSS VSS NMOS_SME l=2u w=0.4u
M12 VDD VBP VBN VDD PMOS_SME l=2u w=2u
M4 VSS cap_1_1 VSS VSS NMOS_SME l={CAP_L} w={CAP_W}
M1 VSS cap_1_2 VSS VSS NMOS_SME l={CAP_L} w={CAP_W}
M2 VSS cap_2_1 VSS VSS NMOS_SME l={CAP_L} w={CAP_W}
M3 VSS cap_2_2 VSS VSS NMOS_SME l={CAP_L} w={CAP_W}
M5 VSS cap_3_1 VSS VSS NMOS_SME l={CAP_L} w={CAP_W}
M6 VSS cap_3_2 VSS VSS NMOS_SME l={CAP_L} w={CAP_W}
M7 VSS cap_4_1 VSS VSS NMOS_SME l={CAP_L} w={CAP_W}
M8 VSS cap_4_2 VSS VSS NMOS_SME l={CAP_L} w={CAP_W}
* Custom Voltage-Controlled Delay Line (VCDL)
.inc library.mod
* TA advice: add another non-starved inverter to get back into a digital signal ? or just at the end ?
* 4x Non-Inverting Delay Elements (two current-starved inverters followed by a Schmitt trigger)
* bias voltage generator for the current-starved inverters
* slightly large area (~110μm^2)
* acts as ~500fF cap
* slightly large area (~110μm^2)
* acts as ~500fF cap
* slightly large area (~110μm^2)
* acts as ~500fF cap
* slightly large area (~110μm^2)
* acts as ~500fF cap
* slightly large area (~110μm^2)
* acts as ~500fF cap
* slightly large area (~110μm^2)
* acts as ~500fF cap
* slightly large area (~110μm^2)
* acts as ~500fF cap
* slightly large area (~110μm^2)
* acts as ~500fF cap
.param CAP_L=10u CAP_W=11u
* capacitors for extra delay
.ends my_vcdl

.subckt my_current_starved_inverter IN OUT VDD VSS VBP VBN
M3 N002 IN OUT VDD PMOS_SME l=0.35u w=1.2u
M4 OUT IN N003 VSS NMOS_SME l=0.35u w=0.4u
M1 N001 VBP N002 VDD PMOS_SME l=2u w=2.35u
M2 N003 VBN N004 VSS NMOS_SME l=2u w=0.4u
M5 N004 VBN VSS VSS NMOS_SME l=2u w=0.4u
M6 VDD VBP N001 VDD PMOS_SME l=2u w=2.35u
* S
* S
* D
* D
* G
* G
* B
* B
.inc library.mod
* Custom current-starved inverter
* cascode? -> output resistance increases (from $r_o$ to roughly $g_m \cdot r_o^2$ ?)
* cascode? -> output resistance increases (from $r_o$ to roughly $g_m \cdot r_o^2$ ?)
* starvation pmos
* starvation nmos
.ends my_current_starved_inverter

.subckt my_schmitt_trigger IN OUT VDD VSS
M1 VDD IN N001 VDD PMOS_SME l=0.35u w=2u
M2 n_inv IN N002 VSS NMOS_SME l=0.35u w=1u
M3 N001 IN n_inv VDD PMOS_SME l=0.35u w=2u
M4 N002 IN VSS VSS NMOS_SME l=0.35u w=1u
M5 VSS n_inv N001 VDD PMOS_SME l=0.35u w=0.8u
M6 N002 n_inv VDD VSS NMOS_SME l=0.35u w=0.4u
X§X1 n_inv OUT VDD VSS my_inverter
* Custom Schmitt trigger
.inc library.mod
* /!\
* /!\
* not VDD
* not VSS
.ends my_schmitt_trigger

.model NMOS NMOS
.model PMOS PMOS
.lib standard.mos
* Custom Delay-Locked Loop (DLL)
.inc library.mod
* PFD
* CP
* VCDL
* NOT DONE ANYMORE: IC: just to avoid waiting super long for the simulation
*                   to run in order to reach a couple thousand clock cycles
*                   for the DLL to lock: .ic V(vctrl)=0.6
* M2 acts as ~1pF cap
* M2: slightly large area (~220μm^2)
.backanno
.end